# Altium schematic sheet Power Supplies.SchDoc: Grandmaster Power Supplies
size Tabloid; Author: N Smith; Revision: A; SheetNumber: 1; SheetTotal: 6; Customer: 01910
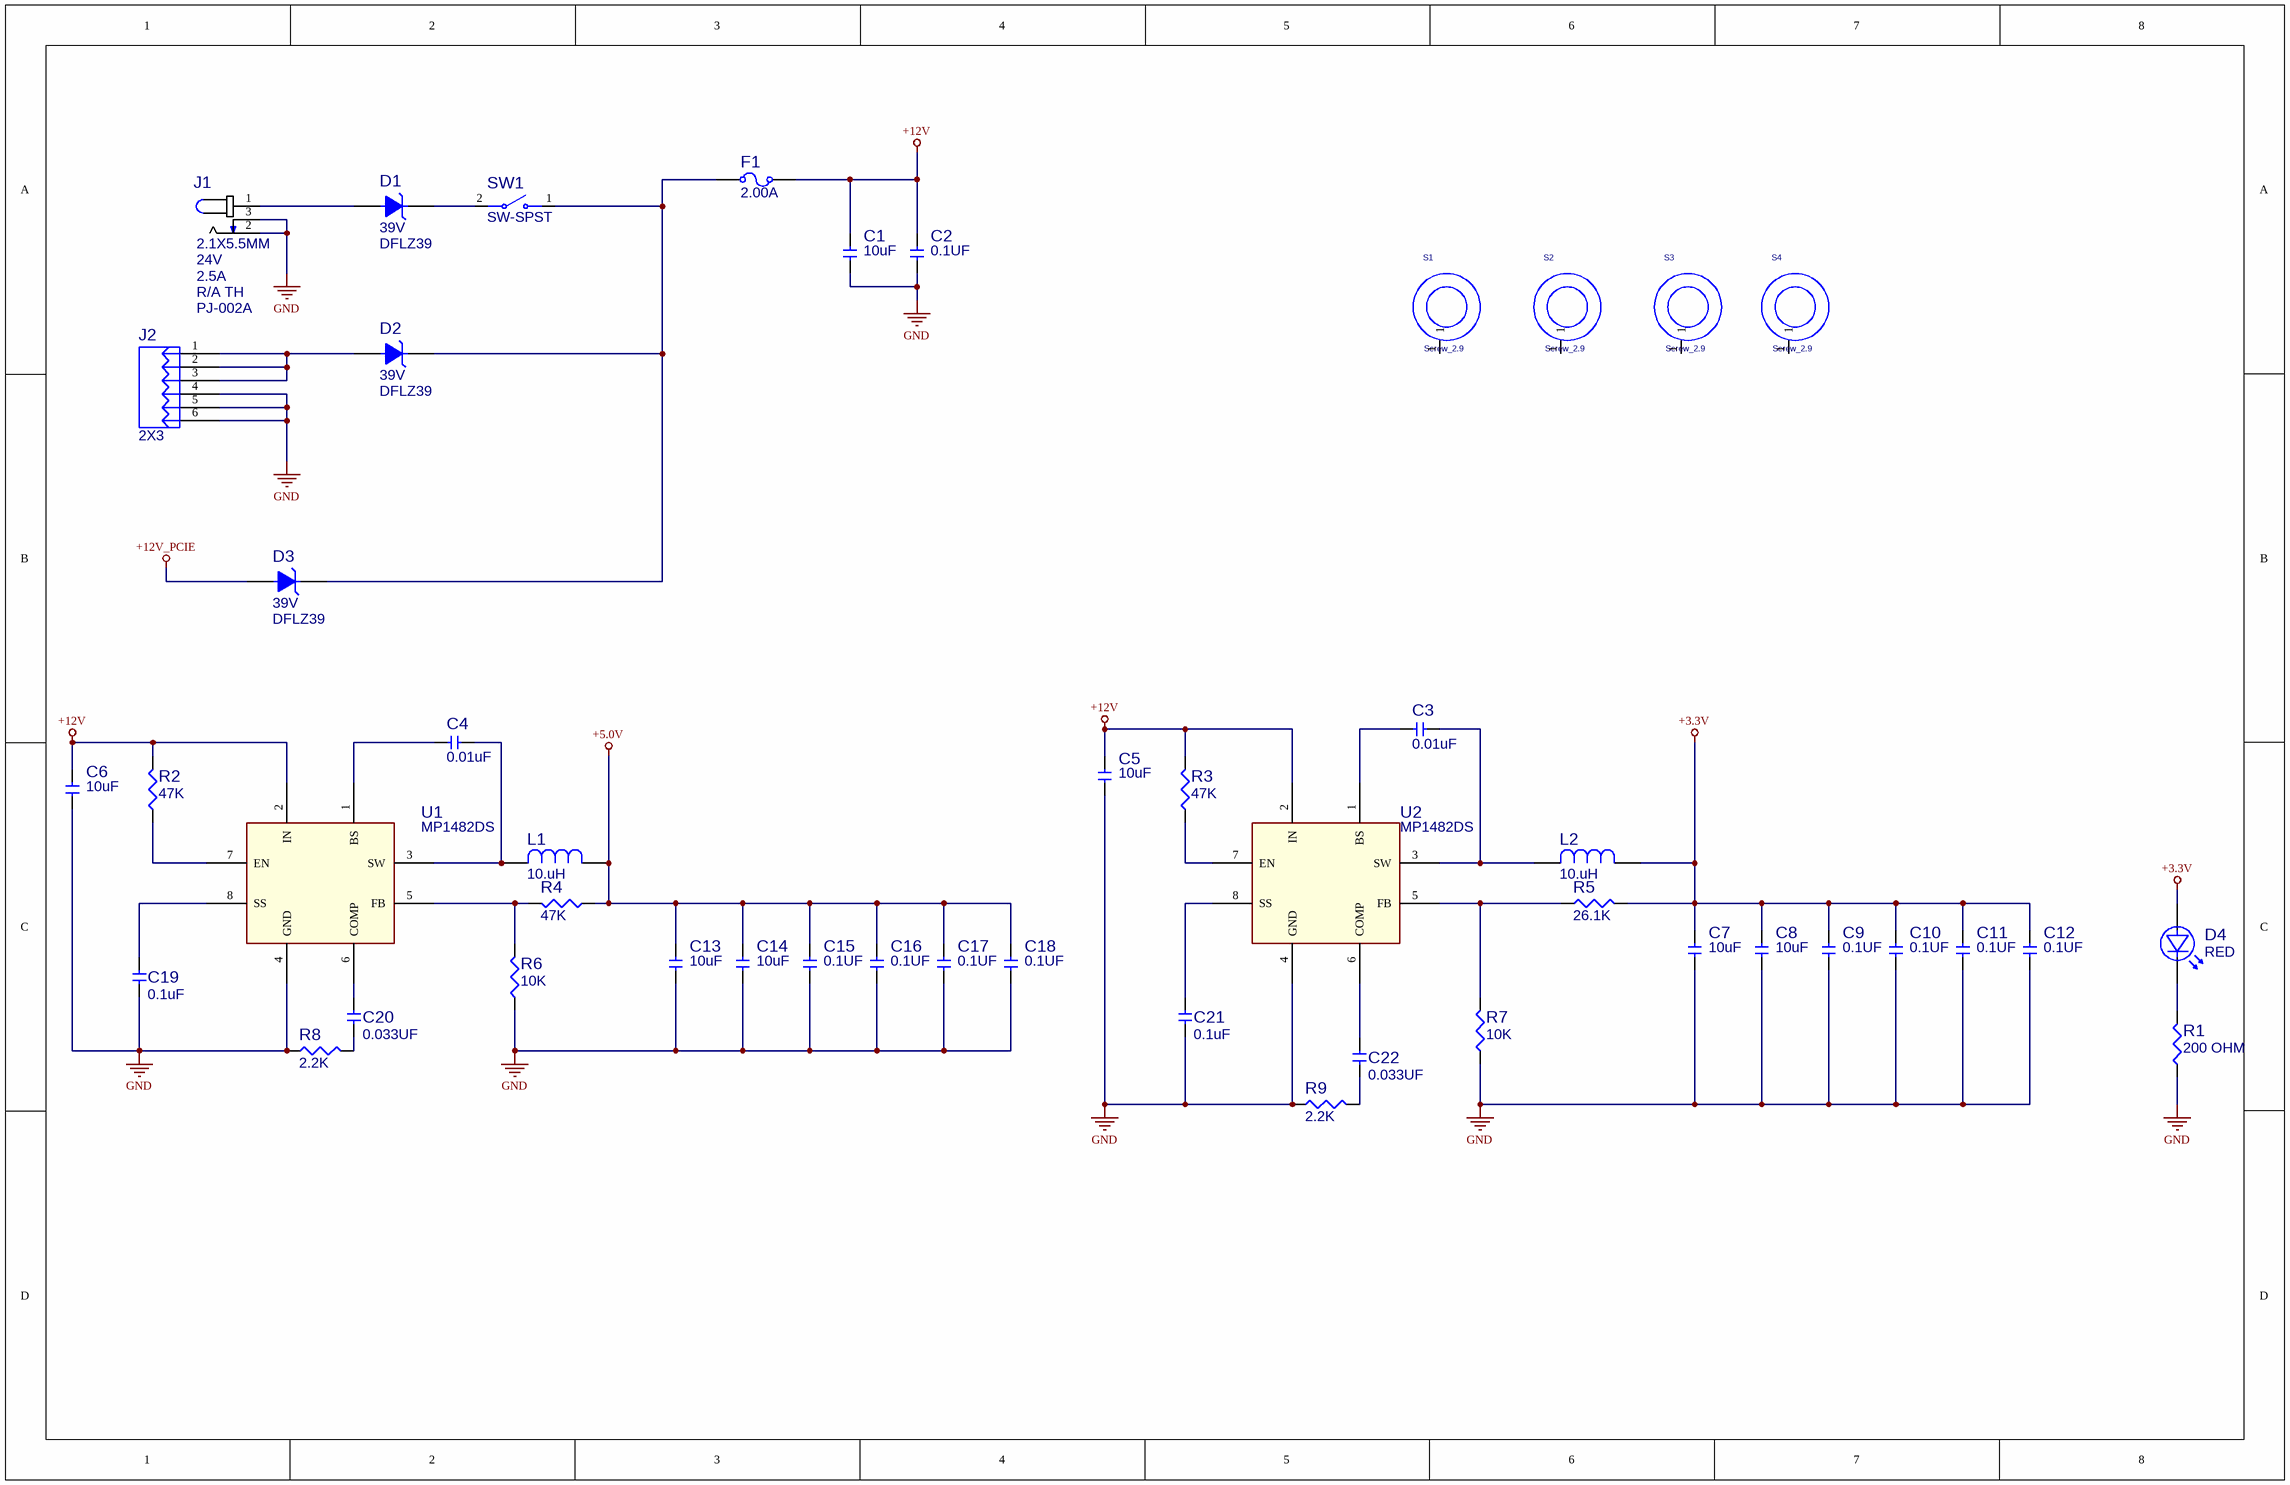
[diagram p0: Power Supplies.SchDoc]

## Parts
C1  value 10uF  [CAPC2012X14N]  (hidden comment: CAP_0805_10UF_25V)
C2  value 0.1UF  [CAPC1005X06N]  (hidden comment: CAP_0402_0.1UF_50V)
C3  value 0.01uF  [CAPC1608X10N]  (hidden comment: CAP_0603_0.01UF_50V)
C4  value 0.01uF  [CAPC1608X10N]  (hidden comment: CAP_0603_0.01UF_50V)
C5  value 10uF  [CAPC2012X14N]  (hidden comment: CAP_0805_10UF_25V)
C6  value 10uF  [CAPC2012X14N]  (hidden comment: CAP_0805_10UF_25V)
C7  value 10uF  [CAPC2012X14N]  (hidden comment: CAP_0805_10UF_25V)
C8  value 10uF  [CAPC2012X14N]  (hidden comment: CAP_0805_10UF_25V)
C9  value 0.1UF  [CAPC1005X06N]  (hidden comment: CAP_0402_0.1UF_50V)
C10  value 0.1UF  [CAPC1005X06N]  (hidden comment: CAP_0402_0.1UF_50V)
C11  value 0.1UF  [CAPC1005X06N]  (hidden comment: CAP_0402_0.1UF_50V)
C12  value 0.1UF  [CAPC1005X06N]  (hidden comment: CAP_0402_0.1UF_50V)
C13  value 10uF  [CAPC2012X14N]  (hidden comment: CAP_0805_10UF_25V)
C14  value 10uF  [CAPC2012X14N]  (hidden comment: CAP_0805_10UF_25V)
C15  value 0.1UF  [CAPC1005X06N]  (hidden comment: CAP_0402_0.1UF_50V)
C16  value 0.1UF  [CAPC1005X06N]  (hidden comment: CAP_0402_0.1UF_50V)
C17  value 0.1UF  [CAPC1005X06N]  (hidden comment: CAP_0402_0.1UF_50V)
C18  value 0.1UF  [CAPC1005X06N]  (hidden comment: CAP_0402_0.1UF_50V)
C19  value 0.1uF  [CAPC1608X10N]  (hidden comment: CAP_0603_0.1UF_50V)
C20  value 0.033UF  [CAPC1005X06N]  (hidden comment: CGA2B3X5R1H333K050BB)
C21  value 0.1uF  [CAPC1608X10N]  (hidden comment: CAP_0603_0.1UF_50V)
C22  value 0.033UF  [CAPC1005X06N]  (hidden comment: CGA2B3X5R1H333K050BB)
D1  value DFLZ39  P1: 39V  [SODFL370X135-2N]  (hidden comment: DFLZ39-TP)
D2  value DFLZ39  P1: 39V  [SODFL370X135-2N]  (hidden comment: DFLZ39-TP)
D3  value DFLZ39  P1: 39V  [SODFL370X135-2N]  (hidden comment: DFLZ39-TP)
D4  RED  [DIOM1608X06N]
F1  value 2.00A  [FUSM1608X60N]  (hidden comment: FUSE_0603_2.00A)
J1  P1: 2.1X5.5MM  P2: 24V  P3: 2.5A  SIZE: R/A TH  [CUI_PJ-002A]  (hidden comment: PJ-002A)
J2  value 2X3  [39-30-1060]  (hidden comment: 39-30-1060)
L1  value 10.uH  [IND_PM124SH]  (hidden comment: PM124SH-100M-RC)
L2  value 10.uH  [IND_PM124SH]  (hidden comment: PM124SH-100M-RC)
R1  value 200 OHM  [RESC1608X50N]  (hidden comment: ERJ-3EKF2000V)
R2  value 47K  [RESC1608X50N]  (hidden comment: ERJ-3EKF4702V)
R3  value 47K  [RESC1608X50N]  (hidden comment: ERJ-3EKF4702V)
R4  value 47K  [RESC1608X50N]  (hidden comment: ERJ-3EKF4702V)
R5  value 26.1K  [RESC1608X50N]  (hidden comment: ERJ-3EKF2612V)
R6  value 10K  [RESC1608X50N]  (hidden comment: ERJ-3EKF1002V)
R7  value 10K  [RESC1608X50N]  (hidden comment: ERJ-3EKF1002V)
R8  value 2.2K  [RESC1608X50N]  (hidden comment: ERJ-3EKF2201V)
R9  value 2.2K  [RESC1608X50N]  (hidden comment: ERJ-3EKF2201V)
S1  Screw_2.9  [MH_250H125]
S2  Screw_2.9  [MH_250H125]
S3  Screw_2.9  [MH_250H125]
S4  Screw_2.9  [MH_250H125]
SW1  value SW-SPST  [L101011MS02Q]  (hidden comment: L101011MS02Q)
U1  value MP1482DS  [SOIC127P600X175-8N]  (hidden comment: MP1482DS-LF)
U2  value MP1482DS  [SOIC127P600X175-8N]  (hidden comment: MP1482DS-LF)

## Nets
+3.3V: C7.1 C8.1 C9.1 C10.1 C11.1 C12.1 D4.2(A) L2.1 R5.2
+5.0V: C13.1 C14.1 C15.1 C16.1 C17.1 C18.1 L1.1 R4.1
+12V: C1.1 C2.1 C5.1 C6.1 F1.2 R2.2 R3.2 U1.2(IN) U2.2(IN)
+12V_PCIE: D3.2(A)
GND: C1.2 C2.2 C5.2 C6.2 C7.2 C8.2 C9.2 C10.2 C11.2 C12.2 C13.2 C14.2 C15.2 C16.2 C17.2 C18.2 C19.1 C21.1 J1.2 J1.3 J2.4 J2.5 J2.6 R1.1 R6.1 R7.1 R8.1 R9.1 U1.4(GND) U2.4(GND)
NetC3_1: C3.1 U2.1(BS)
NetC3_2: C3.2 L2.2 U2.3(SW)
NetC4_1: C4.1 U1.1(BS)
NetC4_2: C4.2 L1.2 U1.3(SW)
NetC19_2: C19.2 U1.8(SS)
NetC20_1: C20.1 U1.6(COMP)
NetC20_2: C20.2 R8.2
NetC21_2: C21.2 U2.8(SS)
NetC22_1: C22.1 U2.6(COMP)
NetC22_2: C22.2 R9.2
NetD1_1: D1.1(C) SW1.2
NetD1_2: D1.2(A) J1.1
NetD2_1: D2.1(C) D3.1(C) F1.1 SW1.1
NetD2_2: D2.2(A) J2.1 J2.2 J2.3
NetD4_1: D4.1(K) R1.2
NetR2_1: R2.1 U1.7(EN)
NetR3_1: R3.1 U2.7(EN)
NetR4_2: R4.2 R6.2 U1.5(FB)
NetR5_1: R5.1 R7.2 U2.5(FB)

Not connected (* = marked no-connect by the designer): S1 1; S2 1; S3 1; S4 1

## Library data of the parts
C1 C5-C8 C13 C14 = CAP_0805_10UF_25V: CAP, CER, 10.UF, 25V, 10%, X5R, 0805; MFG PART NUM: TMK212BBJ106KG-T; VALENTIUM PART NUM: <VALENTIUM>; MFG NAME: TAIYO YUDEN; MAXTEMP: 85C; MINTEMP: -55C; DESC: CAP, CER, 10.UF, 10V, 10%, X5R, 0805; MODIFY DATE: 10/23/2013; CATEGORY: CAP, CER; Date: 4/11/2006 3:37:28 PM; SHEETPART: *; P1: 10%; P2: 25V; P3: X5R; Size: 0805; Supplier 1: MOUSER; Supplier Part Number 1: 963-TMK212BBJ106KG-T
C2 C9-C12 C15-C18 = CAP_0402_0.1UF_50V: CAP, CER, 0.1UF, 50V, 10%, X7R, AEC-Q200, 0402; MFG PART NUM: CGA2B3X7R1H104K050BB; VALENTIUM PART NUM: <VALENTIUM>; MFG NAME: TDK; MAXTEMP: 125C; MINTEMP: -55C; CATEGORY: CAP, CER; MODIFY DATE: 10/23/2013; SHEETPART: *; P1: 10%; OTHER: AEC-Q200; P2: 50V; P3: X7R; Size: 0402; DESC: CAP, CER, 0.1UF, 50V, 10%, X7R, AEC-Q200, 0402; Supplier 1: Digi-Key; Supplier Part Number 1: 445-6899-1-ND
C3 C4 = CAP_0603_0.01UF_50V: CAP, CER, 0.01UF, 50V, 10%, X7R, 0603; MFG PART NUM: C0603C103K5RACTU; VALENTIUM PART NUM: <VALENTIUM>; MFG NAME: KEMET; MAXTEMP: 125C; MINTEMP: -55C; CATEGORY: CAP, CER; MODIFY DATE: 10/23/2013; Date: 7/24/2013; SHEETPART: *; P1: 10%; P2: 50V; P3: X7R; Size: 0603; Supplier 1: Digi-Key; Supplier Part Number 1: 399-1091-1-ND; DESC: CAP, CER, 0.01UF, 50V, 10%, X7R, 0603
C19 C21 = CAP_0603_0.1UF_50V: CAP, CER, 0.1UF, 50V, 10%, X7R, 0603; MFG PART NUM: C0603C104K5RACTU; VALENTIUM PART NUM: <VALENTIUM>; MFG NAME: KEMET; MAXTEMP: 125C; MINTEMP: -55C; CATEGORY: CAP, CER; MODIFY DATE: 10/23/2013; Date: 7/24/2013; SHEETPART: *; P1: 10%; P2: 50V; P3: X7R; Size: 0603; Supplier 1: Digi-Key; Supplier Part Number 1: 399-5089-1-ND; DESC: CAP, CER, 0.1UF, 50V, 10%, X7R, 0603
C20 C22 = CAP_0402_0.033UF_50V: CAP, CER, 0.033UF, 50V, 10%, X7R, AEC-Q200, 0402; VALENTIUM PART NUM: <VALENTIUM>; MFG NAME: TDK; MAXTEMP: 85C; MINTEMP: -55C; CATEGORY: CAP, CER; MFG PART NUM: CGA2B3X5R1H333K050BB; MODIFY DATE: 10/23/2013; SHEETPART: *; P1: 10%; OTHER: AEC-Q200; P2: 50V; P3: X7R; Size: 0402; DESC: CAP, CER, 0.033UF, 50V, 10%, X7R, AEC-Q200, 0402; Supplier 1: Digi-Key; Supplier Part Number 1: 445-12207-1-ND
D1-D3 = DFLZ39: DIO, ZENER, DFLZ39, 39V, 5%, 1W, SOD123FL; VALENTIUM PART NUM: <VALENTIUM>; MFG NAME: MICRO COMM; MAXTEMP: 150C; MINTEMP: -55C; OTHER: SERIES; MFG PART NUM: DFLZ39-TP; MODIFY DATE: 9/4/2013; CATEGORY: DIO, ZENER; P2: 5%; P3: 1W; SIZE: SOD123FL; SHEETPART: *; DESC: DIO, ZENER, DFLZ39, 39V, 5%, 1W, SOD123FL; Supplier 1: Digi-Key; Supplier Part Number 1: DFLZ39-TPMSDKR-ND
D4 = SMTLED_RED_0603_SML: LED, RED, SML-LX0603, 635NM, 2V, 20MA, 0603; MFG PART NUM: SML-LX0603IW-TR; VALENTIUM PART NUM: <VALENTIUM>; MFG NAME: LUMEX; MAXTEMP: 85C; MINTEMP: -25C; MODIFY DATE: 9/4/2013; CATEGORY: LED; OTHER: SML-LX0603; P1: 635NM; P2: 2V; P3: 20MA; SIZE: 0603; SHEETPART: *; DESC: LED, RED, SML-LX0603, 635NM, 2V, 20MA, 0603; Supplier 1: Digi-Key; Supplier Part Number 1: 67-1548-1-ND; VALUE: RED
F1 = FUSE_0603_2.00A: FUSE SLOW 2.00A 32V M 0603; MFG PART NUM: SF-0603S200-2; VALENTIUM PART NUM: <VALENTIUM>; MFG NAME: BOURNS; MAXTEMP: 105C; MINTEMP: -40C; OTHER: UL E141069; P1: SLOW BLO; DESC: FUSE SLOW 1.25A 32V M 0603; MODIFY DATE: 9/4/2013; CATEGORY: FUSE; DATE: 20 OCT 15; P2: 32V; P3: M; SIZE: 0603; SHEETPART: *; Supplier 1: Digi-Key; Supplier Part Number 1: SF-0603S200-2CT-ND
J1 = PJ-002A: CONN, JACK, PJ-002A, 2.1X5.5MM, 24V 2.5A, R/A TH, SPST-NC; VALENTIUM PART NUM: <VALENTIUM>; MAXTEMP: 85C; MFG NAME: CUI DEVICES; MINTEMP: -25C; CATEGORY: CONN, JACK; DESC: CONN, JACK, PJ-002A, 2.1X5.5MM, 24V 2.5A, R/A TH, SPST-NC; MFG PART NUM: PJ-002A; OTHER: SPST-NC; Supplier 1: Digi-Key; Supplier Part Number 1: CP-002A-ND; Value: PJ-002A
J2 = 39-30-1060: CONN, HDR, 2X3, R/A, 4.2MM, TH, MINI-FIT JR; MFG PART NUM: 105314-1206; VALENTIUM PART NUM: <VALENTIUM>; MFG NAME: MOLEX; MAXTEMP: 105C; MINTEMP: -40C; OTHER: NANO-FIT; P2: 2.5MM; DESC: CONN, HDR, 2X3, R/A, 2.5MM, TH, NANO-FIT; MODIFY DATE: 10/10/2013; CATEGORY: CONN, HDR; P1: R/A; SIZE: TH; Supplier 1: Digi-Key; Supplier Part Number 1: WM14977-ND
L1 L2 = PM124SH-100M-RC: IND, PWR, 10.uH, 20%, 4A, 0.04DCR, 12.5X12.5MM, SHLD; VALENTIUM PART NUM: <VALENTIUM>; MFG NAME: BOURNS; MAXTEMP: 125C; MINTEMP: -40C; P3: 36mOhm; MFG PART NUM: PM124SH-100M-RC; MODIFY DATE: 10/23/2013; Date: 10/23/2013; CATEGORY: IND, PWR; OTHER: SHLD; P1: 20%; P2: 4A; SIZE: 12.5X12.5MM; SHEETPART: *; DESC: IND, PWR, 10.uH, 20%, 4A, 0.04DCR, 12.5X12.5MM, SHLD; Supplier 1: Digi-Key; Supplier Part Number 1: PM124SH-100M-RCCT-ND
R1 = RES_0603_200: RES, 200 OHM, 1%, 1/10W, TF, 0603; VELENTIUM PART NUM: <VELENTIUM>; MFG NAME: PANASONIC; MAXTEMP: 125C; MINTEMP: -55C; OTHER: 100PPM; SUB: GENERIC; ModifyDate: 7/25/2013; MFG PART NUM: ERJ-3EKF2000V; CATEGORY: RES; Date: 7/26/2013; P1: 1%; P3: TF; P2: 1/10W; SIZE: 0603; SHEETPART: *; DESC: RES, 200 OHM, 1%, 1/10W, TF, 0603; Supplier 1: Digi-Key; Supplier Part Number 1: P200HCT-ND
R2-R4 = RES_0603_47K: RES, 47K, 1%, 1/10W, TF, 0603; VELENTIUM PART NUM: <VELENTIUM>; MFG NAME: PANASONIC; MAXTEMP: 125C; MINTEMP: -55C; OTHER: 100PPM; SUB: GENERIC; ModifyDate: 1/22/2014; MFG PART NUM: ERJ-3EKF4702V; CATEGORY: RES; Date: 1/22/2014; P1: 1%; P3: TF; P2: 1/10W; SIZE: 0603; SHEETPART: *; DESC: RES, 47K, 1%, 1/10W, TF, 0603; Supplier 1: Digi-Key; Supplier Part Number 1: P47.0KHCT-ND
R5 = RES_0603_26.1K: RES, 26.1K, 1%, 1/10W, TF, 0603; VELENTIUM PART NUM: <VELENTIUM>; MFG NAME: PANASONIC; MAXTEMP: 125C; MINTEMP: -55C; OTHER: 100PPM; SUB: GENERIC; DESC: RES, 27.1K, 1%, 1/10W, TF, 0603; ModifyDate: 7/25/2013; MFG PART NUM: ERJ-3EKF2612V; CATEGORY: RES; Date: 7/26/2013; P1: 1%; P3: TF; P2: 1/10W; SIZE: 0603; SHEETPART: *; Supplier 1: Digi-Key; Supplier Part Number 1: P26.1KHCT-ND
R6 R7 = RES_0603_10K: RES, 10K, 1%, 1/10W, TF, 0603; VELENTIUM PART NUM: <VELENTIUM>; MFG NAME: PANASONIC; MAXTEMP: 125C; MINTEMP: -55C; OTHER: 100PPM; SUB: GENERIC; ModifyDate: 7/25/2013; MFG PART NUM: ERJ-3EKF1002V; CATEGORY: RES; Date: 7/26/2013; P1: 1%; P3: TF; P2: 1/10W; SIZE: 0603; Supplier 1: Digi-Key; Supplier Part Number 1: P10.0KHCT-ND; SHEETPART: *; DESC: RES, 10K, 1%, 1/10W, TF, 0603
R8 R9 = RES_0603_2.2K: RES, 2.2K, 1%, 1/10W, TF, 0603; VELENTIUM PART NUM: <VELENTIUM>; MFG NAME: PANASONIC; MAXTEMP: 125C; MINTEMP: -55C; OTHER: 100PPM; SUB: GENERIC; ModifyDate: 8/15/2013; MFG PART NUM: ERJ-3EKF2201V; CATEGORY: RES; Date: 8/15/2013; P1: 1%; P3: TF; P2: 1/10W; SIZE: 0603; Supplier 1: Digi-Key; Supplier Part Number 1: P2.20KHCT-ND; SHEETPART: *; DESC: RES, 2.2K, 1%, 1/10W, TF, 0603
S1-S4 = screw_0: FH140 Screw,Diameter 2.9mm; Part Number: 454; Manufacturer: NA; Vendor P/N: NA; Part Type: SMT
SW1 = L101011MS02Q: SW, SPST, 250V, 2A, SLIDE, ON-OFF, TH; VALENTIUM PART NUM: <VALENTIUM>; MFG NAME: C&K; MAXTEMP: 85C; MINTEMP: -25C; MFG PART NUM: L101011MS02Q; MODIFY DATE: 1/21/2014; CATEGORY: SW; DATE: 9/5/2013; OTHER: L101011MS02Q; P1: 250V; P2: 2A; P3: SW, SPST, 250V, 2A, SLIDE, ON-OFF, TH; SIZE: 19.1X10.79MM; SHEETPART: *; DESC: SW, SPST, 250V, 2A, SLIDE, ON-OFF, TH; Supplier 1: Digi-Key; Supplier Part Number 1: CKC5106-ND
U1 U2 = MP1482DS: IC, DC/DC, MP1482DS, >4.75VIN, 0.923-15V OUT, SOIC8; VELENTIUM PART NUM: <V PART NUM>; MFG NAME: MPS; MAXTEMP: +85C; MINTEMP: -40C; OTHER: additional spec; P3: W; MFG PART NUM: MP1482DS-LF; MODIFY DATE: 12/27/2005 8:34:25 AM; CATEGORY: IC, DC/DC; P1: >4.75V IN; P2: 0.923-15V OUT; SIZE: 8SOIC; SHEETPART: *; DESC: IC, DC/DC, MP1482DS, >4.75VIN, 0.923-15V OUT, SOIC8; Supplier 1: Digi-Key; Supplier Part Number 1: 1589-1524-1-ND